# EAGLE design center (EAGLE 9.3.2)
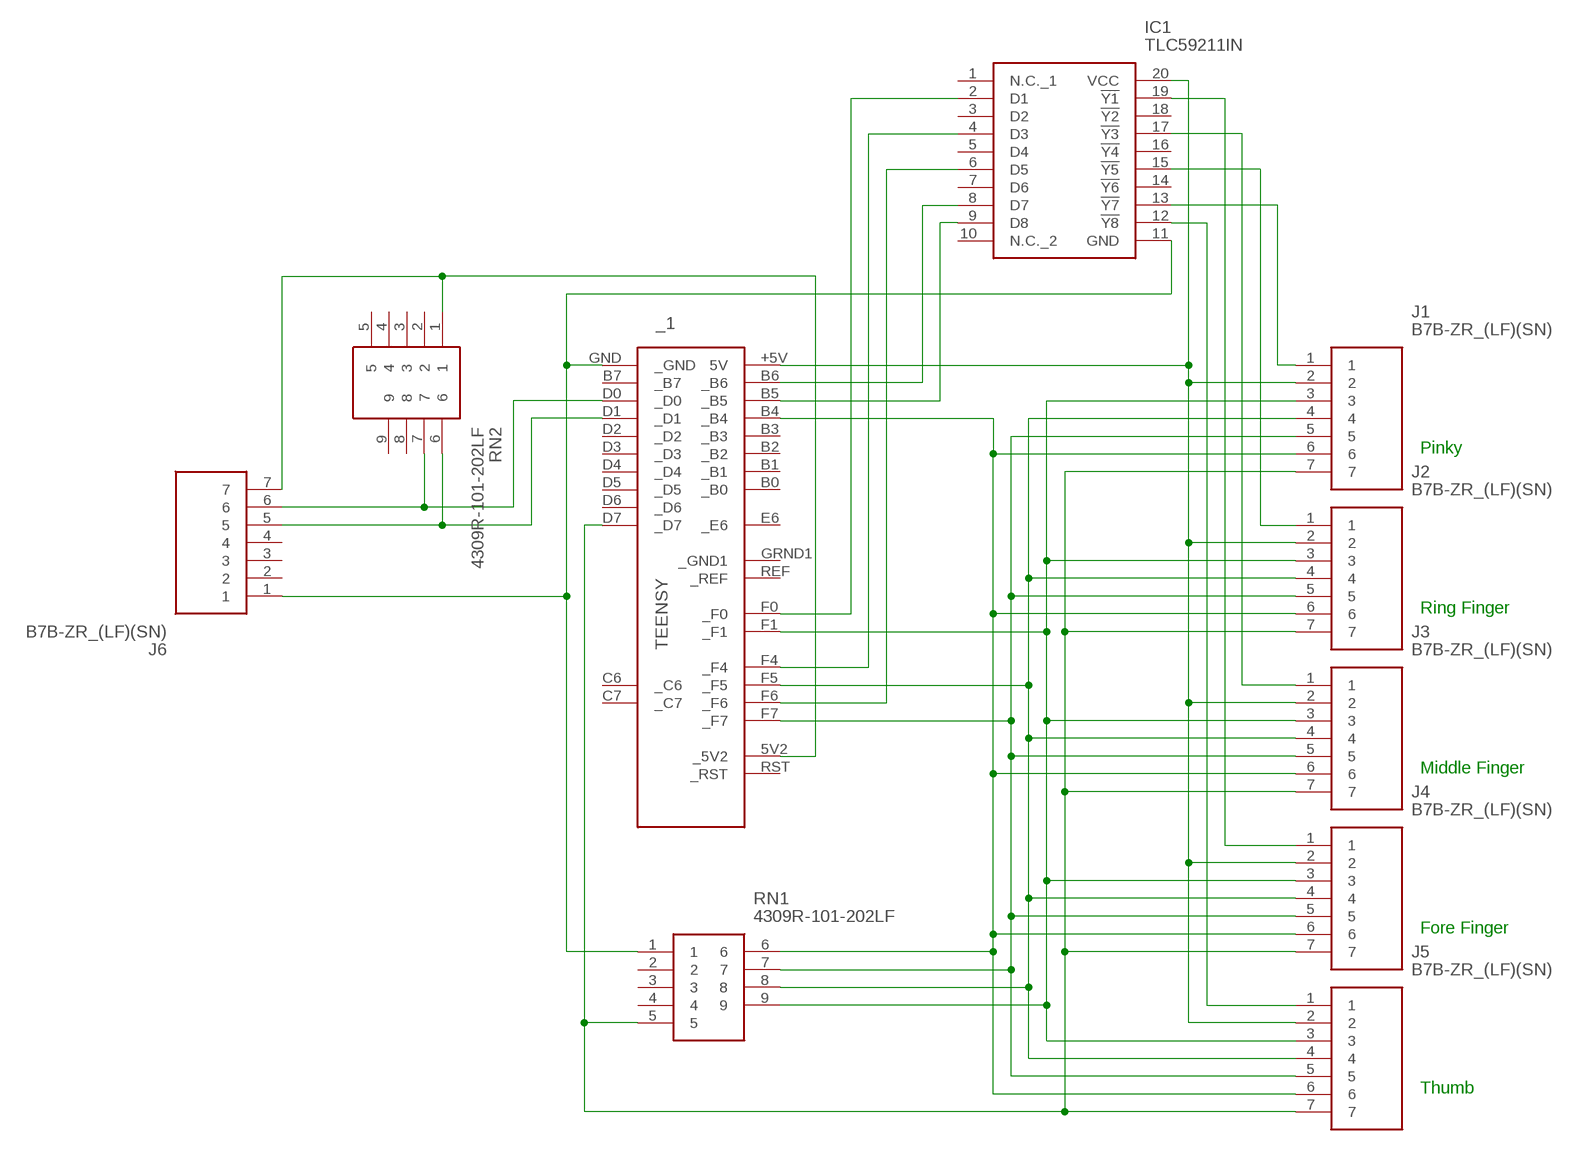
[diagram p0: schematic, sheet 1]

## Parts
_1  TEENSY  [TEENSY]
IC1  TLC59211IN  [DIP794W53P254L2540H508Q20N]
J1  B7B-ZR_(LF)(SN)  [SHDR7W50P0X150_1X7_1200X350X45]
J2  B7B-ZR_(LF)(SN)  [SHDR7W50P0X150_1X7_1200X350X45]
J3  B7B-ZR_(LF)(SN)  [SHDR7W50P0X150_1X7_1200X350X45]
J4  B7B-ZR_(LF)(SN)  [SHDR7W50P0X150_1X7_1200X350X45]
J5  B7B-ZR_(LF)(SN)  [SHDR7W50P0X150_1X7_1200X350X45]
J6  B7B-ZR_(LF)(SN)  [SHDR7W50P0X150_1X7_1200X350X45]
RN1  4309R-101-202LF  [4309R-101]
RN2  4309R-101-202LF  [4309R-101]

## Nets
N$1: _1.+5V(5V) IC1.20(VCC) J1.2 J2.2 J3.2 J4.2 J5.2
N$2: _1.F1(_F1) J1.3 J2.3 J3.3 J4.3 J5.3 RN1.9
N$3: _1.B4(_B4) J1.6 J2.6 J3.6 J4.6 J5.6 RN1.6
N$4: _1.F5(_F5) J1.4 J2.4 J3.4 J4.4 J5.4 RN1.8
N$5: _1.F7(_F7) J1.5 J2.5 J3.5 J4.5 J5.5 RN1.7
N$6: _1.GND(_GND) IC1.11(GND) J6.1 RN1.1
N$7: _1.D7(_D7) J1.7 J2.7 J3.7 J4.7 J5.7 RN1.5
N$8: _1.B6(_B6) IC1.8(D7)
N$9: _1.B5(_B5) IC1.9(D8)
N$10: _1.F6(_F6) IC1.6(D5)
N$11: _1.F4(_F4) IC1.4(D3)
N$12: _1.F0(_F0) IC1.2(D1)
N$15: IC1.15(!Y5) J2.1
N$18: _1.D1(_D1) J6.5 RN2.6
N$19: _1.5V2(_5V2) J6.7 RN2.1
N$20: _1.D0(_D0) J6.6 RN2.7
N$22: IC1.17(!Y3) J3.1
N$23: IC1.19(!Y1) J4.1
N$24: IC1.12(!Y8) J5.1
N$25: IC1.13(!Y7) J1.1
Unconnected: _1.B0(_B0) _1.B1(_B1) _1.B2(_B2) _1.B3(_B3) _1.B7(_B7) _1.C6(_C6) _1.C7(_C7) _1.D2(_D2) _1.D3(_D3) _1.D4(_D4) _1.D5(_D5) _1.D6(_D6) _1.E6(_E6) _1.GRND1(_GND1) _1.REF(_REF) _1.RST(_RST) IC1.1(N.C._1) IC1.3(D2) IC1.5(D4) IC1.7(D6) IC1.10(N.C._2) IC1.14(!Y6) IC1.16(!Y4) IC1.18(!Y2) J6.2 J6.3 J6.4 RN1.2 RN1.3 RN1.4 RN2.2 RN2.3 RN2.4 RN2.5 RN2.8 RN2.9

## Notes on the sheet
- Pinky
- Ring Finger
- Middle Finger
- Fore Finger
- Thumb

## Library data of the parts
_1 = teensy:TEENSY: Teensy 2.0
IC1 = TLC59211IN:TLC59211IN: 8-Bit DMOS Sink Driver Source: Datasheet <http://www.ti.com/lit/gpn/tlc59211>; DESCRIPTION: 8-Bit DMOS Sink Driver; HEIGHT: 5.08mm; MANUFACTURER_NAME: Texas Instruments; MANUFACTURER_PART_NUMBER: TLC59211IN; MOUSER_PART_NUMBER: 595-TLC59211IN; MOUSER_PRICE-STOCK: https://www.mouser.com/Search/Refine.aspx?Keyword=595-TLC59211IN
J1-J6 = SamacSys_Parts:B7B-ZR_(LF)(SN): Connector,Multipole,PCB use,B7B-ZR (LF)( JST ZH Series, 1.5mm Pitch 7 Way 1 Row Straight PCB Header, Solder Termination, 1A Source: Datasheet <http://docs-emea.rs-online.com/webdocs/1147/0900766b81147f94.pdf>; DESCRIPTION: Connector,Multipole,PCB use,B7B-ZR (LF)( JST ZH Series, 1.5mm Pitch 7 Way 1 Row Straight PCB Header, Solder Termination, 1A; HEIGHT: 4.5mm; MANUFACTURER_NAME: JST (JAPAN SOLDERLESS TERMINALS); MANUFACTURER_PART_NUMBER: B7B-ZR (LF)(SN); RS_PART_NUMBER: 7620828; RS_PRICE-STOCK: https://uk.rs-online.com/web/p/products/7620828
RN1 RN2 = 4309R-101-202LF:4309R-101-202LF: Resistor Networks & Arrays 9pin 2Kohms Bussed Low Profile Source: Datasheet <https://componentsearchengine.com/Datasheets/1/4309R-101-202LF.pdf>; DESCRIPTION: Resistor Networks & Arrays 9pin 2Kohms Bussed Low Profile; HEIGHT: mm; MANUFACTURER_NAME: Bourns; MANUFACTURER_PART_NUMBER: 4309R-101-202LF; MOUSER_PART_NUMBER: 652-4309R-1LF-2K; MOUSER_PRICE-STOCK: https://www.mouser.com/Search/Refine.aspx?Keyword=652-4309R-1LF-2K

## Board
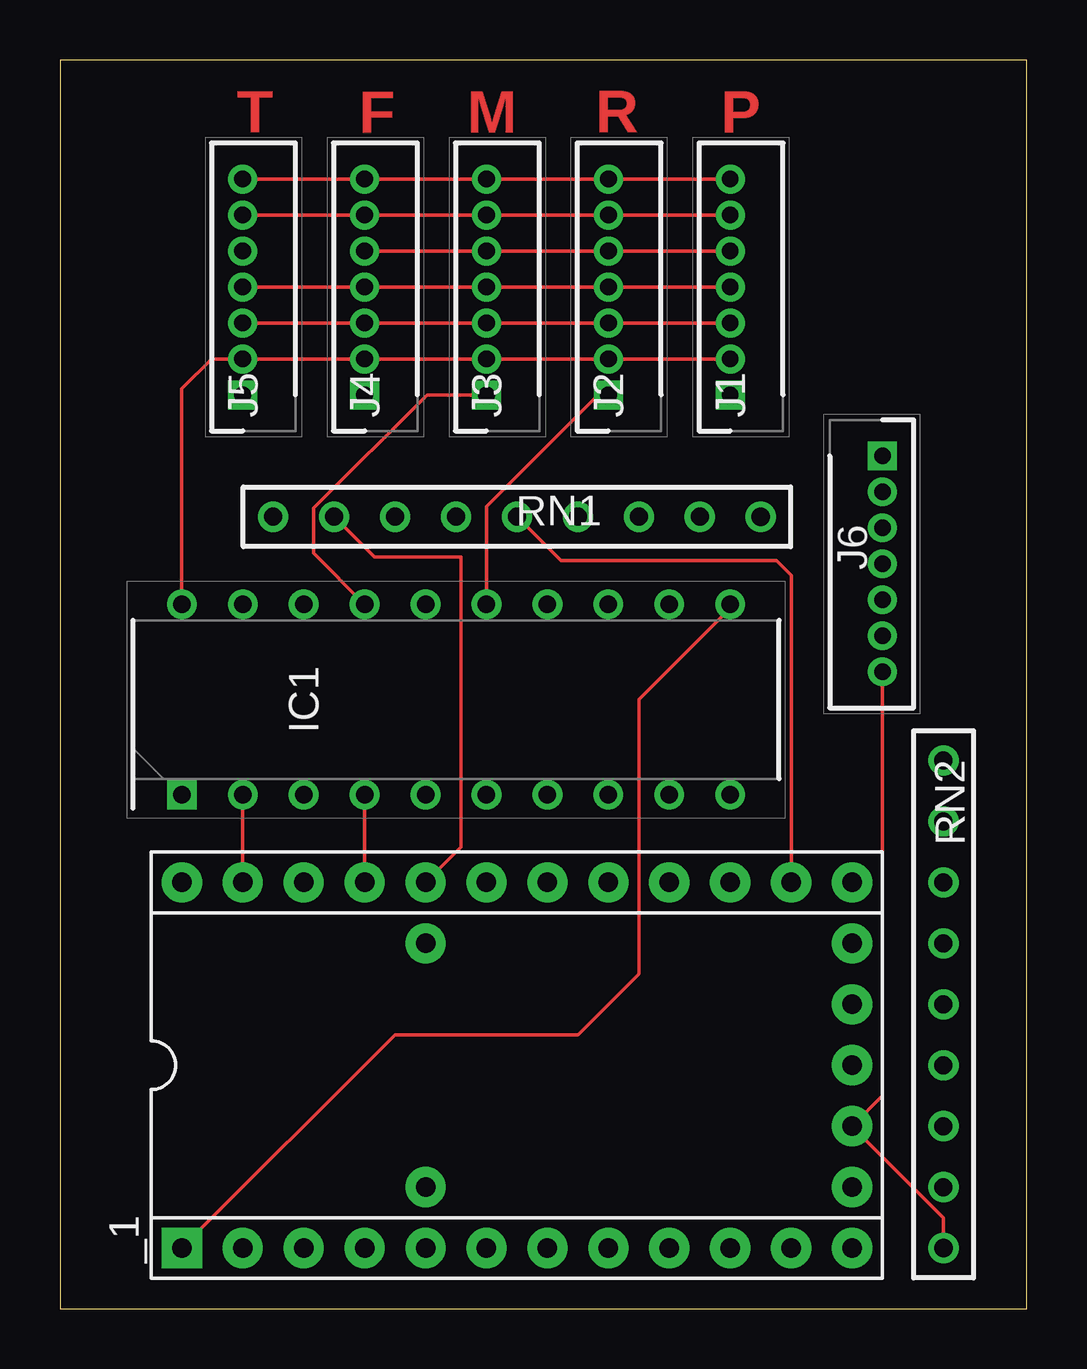
[diagram p1: board, top side]
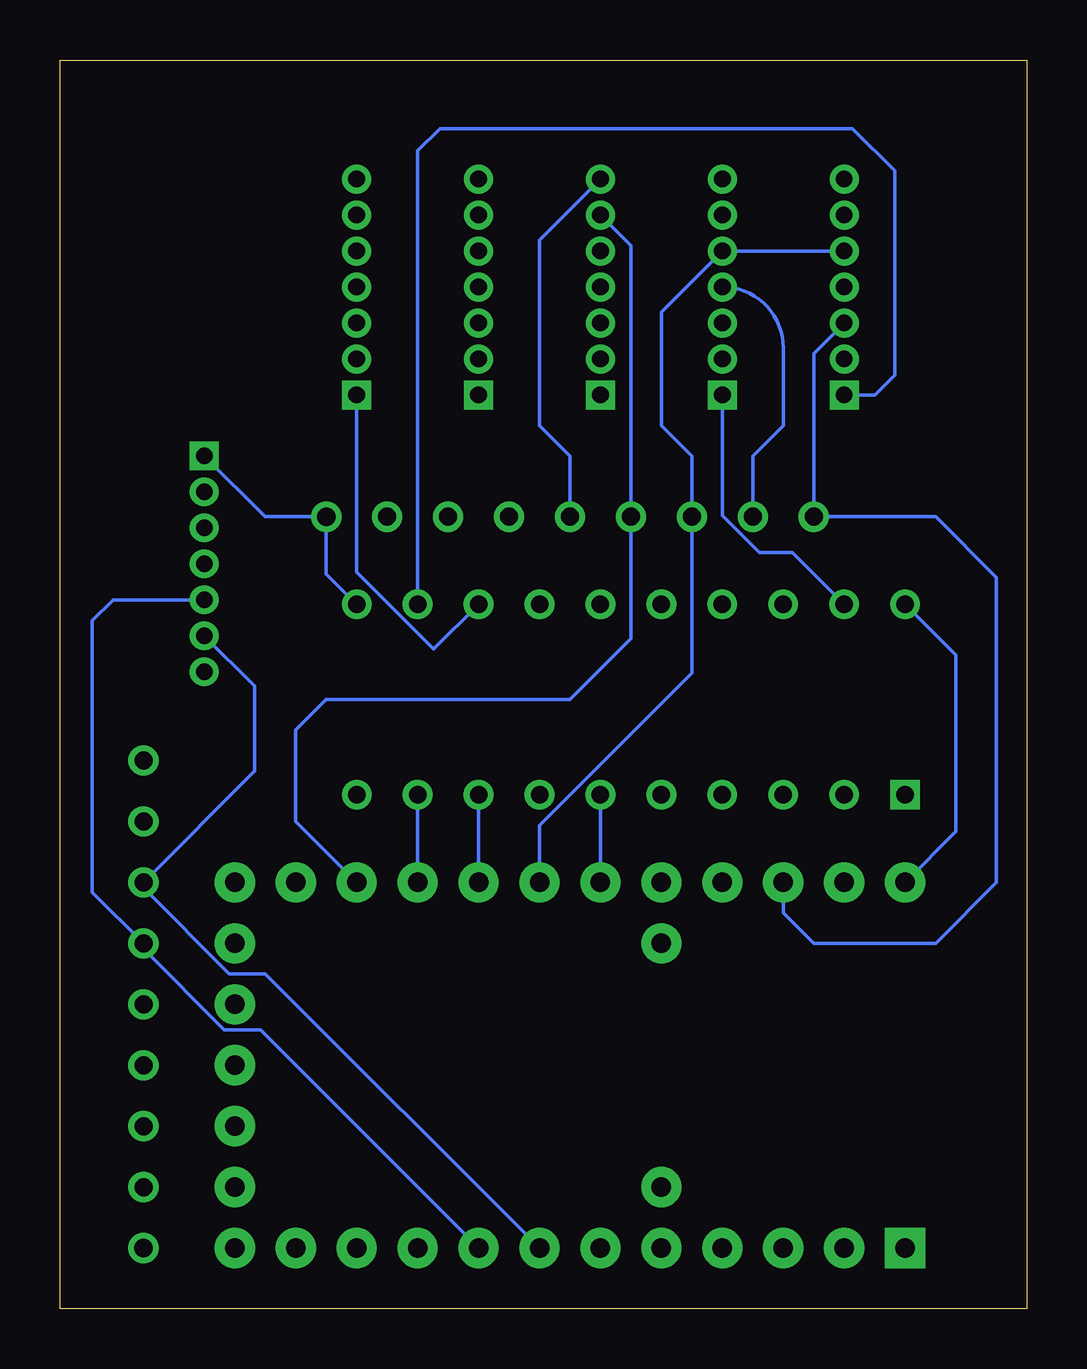
[diagram p2: board, bottom side, seen from below]

Size 40.31 x 52.06 mm. Coordinates in mm from the lower left corner, seen from the top.
Outline: 0,0 40.31,0 40.31,52.06 0,52.06 0,0
Copper layers (1*16): Top 0.035mm / dielectric 1.5mm / Bottom 0.035mm
Design rules "default": minimum track width 6mil, minimum drill 0.35mm, track to track 6mil, track to pad 6mil, pad to pad 6mil, via to via 6mil, smd to smd 6mil, copper to edge 40mil, drill to drill 6mil, minimum pad ring 10mil, minimum via ring 8mil, stop-mask expansion 4mil, vias tented up to drill 0mil, thermal gap 10mil

### Footprints (pad centres in the part's own frame; a part is rotated, then mirrored left to right if it is on the bottom)
TEENSY = drill 0.813 pad 1.676: 5V2 13.97,-2.54; +5V -13.97,7.62; B0 -11.43,-7.62; B1 -8.89,-7.62; B2 -6.35,-7.62; B3 -3.81,-7.62; B4 8.89,7.62; B5 6.35,7.62; B6 3.81,7.62; B7 -1.27,-7.62; C6 11.43,-7.62; C7 13.97,-7.62; D0 1.27,-7.62; D1 3.81,-7.62; D2 6.35,-7.62; D3 8.89,-7.62; D4 13.97,5.08; D5 13.97,-5.08; D6 13.97,7.62; D7 11.43,7.62; E6 -3.81,-5.08; F0 -11.43,7.62; F1 -8.89,7.62; F4 -6.35,7.62; F5 -3.81,7.62; F6 -1.27,7.62; F7 1.27,7.62; GRND1 13.97,0; REF -3.81,5.08; RST 13.97,2.54 | drill 0.813 pad 1.676 square: GND -13.97,-7.62
DIP794W53P254L2540H508Q20N = drill 0.73 pad 1.13 square: 1 -3.97,11.43 | drill 0.73 pad 1.13: 2 -3.97,8.89; 3 -3.97,6.35; 4 -3.97,3.81; 5 -3.97,1.27; 6 -3.97,-1.27; 7 -3.97,-3.81; 8 -3.97,-6.35; 9 -3.97,-8.89; 10 -3.97,-11.43; 11 3.97,-11.43; 12 3.97,-8.89; 13 3.97,-6.35; 14 3.97,-3.81; 15 3.97,-1.27; 16 3.97,1.27; 17 3.97,3.81; 18 3.97,6.35; 19 3.97,8.89; 20 3.97,11.43
SHDR7W50P0X150_1X7_1200X350X45 = drill 0.7 pad 1.1 square: 1 0,0 | drill 0.7 pad 1.1: 2 1.5,0; 3 3,0; 4 4.5,0; 5 6,0; 6 7.5,0; 7 9,0
4309R-101 = drill 0.77 pad 1.27: 1 0,0 | drill 0.75 pad 1.25: 2 2.54,0; 3 5.08,0; 4 7.62,0; 5 10.16,0; 6 12.7,0; 7 15.24,0; 8 17.78,0; 9 20.32,0

### Placement (x,y rotation side)
_1  19.05,10.16 0 top
IC1  16.51,25.4 90 top
J1  27.94,38.1 90 top
J2  22.86,38.1 90 top
J3  17.78,38.1 90 top
J4  12.7,38.1 90 top
J5  7.62,38.1 90 top
J6  34.29,35.56 270 top
RN1  29.21,33.02 180 top
RN2  36.83,2.54 90 top

### Tracks (layer width: path | path; a pad name or v marks a point on that pad's centre or on a via)
N$1
  Top 0.152: 27.97,39.6 J1.2 J2.2 J3.2 J4.2 J5.2 | 7.65,39.6 J5.2 | J5.2 6.32,39.6 5.08,38.36 IC1.20
  Bottom 0.152: _1.+5V 2.96,19.9 2.96,27.25 IC1.20
N$2
  Top 0.152: J1.3 J2.3 J3.3 J4.3 J5.3
  Bottom 0.152: J5.3 8.89,39.83 RN1.9 3.81,33.02 1.27,30.48 1.27,17.78 3.81,15.24 8.89,15.24 10.16,16.51 _1.F1
N$3
  Top 0.152: J5.6 J4.6 J3.6 J2.6 J1.6
  Bottom 0.152: J3.6 16.51,44.33 RN1.6 16.51,27.94 19.05,25.4 29.21,25.4 30.48,24.13 30.48,20.32 _1.B4
N$4
  Top 0.152: J1.4 J2.4 J3.4 J4.4 J5.4 | RN1.8 13.11,31.34 16.73,31.34 16.73,19.27 _1.F5 16.31,18.85
  Bottom 0.152: J4.4 arc90 10.16,40.06 10.16,36.83 11.43,35.56 RN1.8
N$5
  Top 0.152: J1.5 J2.5 J3.5 J4.5
  Bottom 0.152: _1.F7 20.32,20.16 13.97,26.51 RN1.7 13.97,35.56 15.24,36.83 15.24,41.56 J4.5 J5.5
N$6
  Top 0.152: _1.GND 13.97,11.43 21.59,11.43 24.13,13.97 24.13,25.4 27.94,29.21 IC1.11
  Bottom 0.152: J6.1 31.75,33.02 RN1.1 29.21,30.64 IC1.11
N$7
  Top 0.152: _1.D7 30.48,30.57 29.86,31.19 20.88,31.19 RN1.5 | J1.7 J2.7 J3.7 J4.7 J5.7
  Bottom 0.152: RN1.5 19.05,35.56 20.32,36.83 20.32,44.56 J3.7
N$8
  Bottom 0.152: _1.B6 IC1.8
N$9
  Bottom 0.152: IC1.9 _1.B5
N$10
  Bottom 0.152: IC1.6 _1.F6
N$11
  Top 0.152: IC1.4 _1.F4
N$12
  Top 0.152: IC1.2 _1.F0
N$15
  Top 0.152: J2.1 22.43,38.1 17.78,33.45 IC1.15
N$18
  Bottom 0.152: _1.D1 31.95,11.63 33.46,11.63 36.83,15 RN2.6 38.96,17.37 38.96,28.7 38.1,29.56 J6.5
N$19
  Top 0.152: J6.7 34.29,8.89 _1.5V2 36.83,3.81 RN2.1
N$20
  Bottom 0.152: _1.D0 31.75,13.97 33.26,13.97 36.83,17.54 RN2.7 32.19,22.42 32.19,25.96 J6.6
N$22
  Top 0.152: IC1.17 10.57,31.5 10.57,33.38 15.3,38.1 J3.1
N$23
  Bottom 0.152: IC1.19 9.77,31.52 11.14,31.52 12.7,33.08 J4.1
N$24
  Bottom 0.152: IC1.12 25.4,48.28 24.47,49.2 7.28,49.2 5.52,47.45 5.52,38.93 6.35,38.1 J5.1
N$25
  Bottom 0.152: IC1.13 24.73,27.5 27.94,30.71 J1.1

### Text on the board
Top: T | F | M | R | P